# Altium schematic sheet USB-connector.SchDoc
size B; SheetNumber: 1; SheetTotal: 1
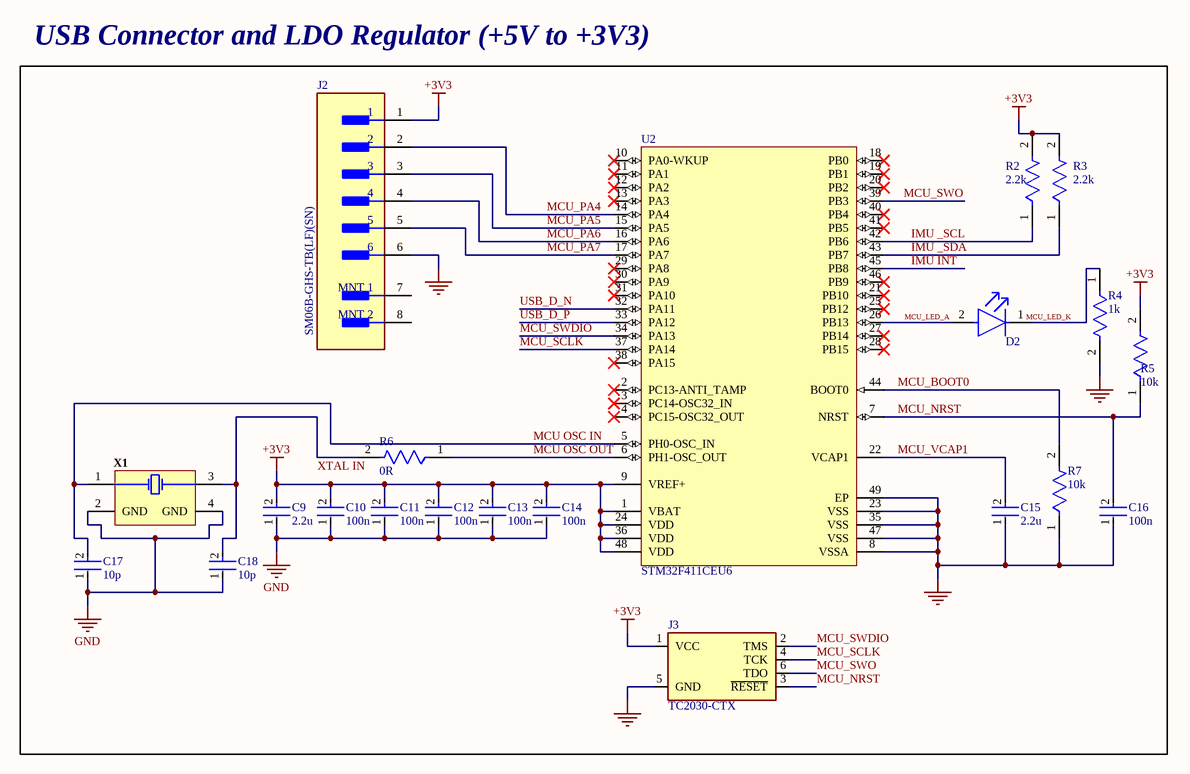
[diagram p0: USB-connector.SchDoc]

## Parts
C9  2.2u  [FP-GRM15-MFG]
C10  100n  [FP-GRM15-MFG]
C11  100n  [FP-GRM15-MFG]
C12  100n  [FP-GRM15-MFG]
C13  100n  [FP-GRM15-MFG]
C14  100n  [FP-GRM15-MFG]
C15  2.2u  [FP-GRM15-MFG]
C16  100n  [FP-GRM15-MFG]
C17  10p  [FP-GRM15-MFG]
C18  10p  [FP-GRM15-MFG]
D2  SML-P11UTT86  [FP-SML-P11UTT86-MFG]  (value not drawn)
J2  SM06B-GHS-TB(LF)(SN)  [FP-SM06B-GHS-TB_LF_SN-MFG]
J3  TC2030-CTX  [TC2030-IDC-NL]
R2  2.2k  [FP-CRCW0402-e3-IPC_C]
R3  2.2k  [FP-CRCW0402-e3-IPC_C]
R4  1k  [FP-CRCW0402-e3-IPC_C]
R5  10k  [FP-CRCW0402-e3-IPC_C]
R6  0R  [FP-CRCW0402-e3-IPC_C]
R7  10k  [FP-CRCW0402-e3-IPC_C]
U2  STM32F411CEU6  [STM-UFQFPN48_L]
X1  TSX-3225 24.0000MF15X-AC3  [EPSON-TSX-3225_V]  (value not drawn)

## Blocks framed on the sheet
USB Connector and LDO Regulator (+5V to +3V3): C9-C18 D2 J2 J3 R2-R7 U2 X1

## Nets
+3V3: C9.2 C10.2 C11.2 C12.2 C13.2 C14.2 J2.1 J3.1(VCC) R2.2 R3.2 R5.2 U2.1(VBAT) U2.9(VREF+) U2.24(VDD) U2.36(VDD) U2.48(VDD)
GND: C9.1 C10.1 C11.1 C12.1 C13.1 C14.1 C15.1 C16.1 C17.1 C18.1 J2.6 J3.5(GND) R4.2 R7.1 U2.8(VSSA) U2.23(VSS) U2.35(VSS) U2.47(VSS) U2.49(EP) X1.2(GND) X1.4(GND)
IMU _SCL: R2.1 U2.42(PB6)
IMU _SDA: R3.1 U2.43(PB7)
IMU INT: U2.45(PB8)
MCU OSC IN: C17.2 U2.5(PH0-OSC_IN) X1.1(X1)
MCU OSC OUT: R6.1 U2.6(PH1-OSC_OUT)
MCU_BOOT0: R7.2 U2.44(BOOT0)
MCU_LED_A: D2.2(A) U2.26(PB13)
MCU_LED_K: D2.1(C) R4.1
MCU_NRST: C16.2 J3.3(~{RESET}) R5.1 U2.7(NRST)
MCU_PA4: J2.2 U2.14(PA4)
MCU_PA5: J2.3 U2.15(PA5)
MCU_PA6: J2.4 U2.16(PA6)
MCU_PA7: J2.5 U2.17(PA7)
MCU_SCLK: J3.4(TCK) U2.37(PA14)
MCU_SWDIO: J3.2(TMS) U2.34(PA13)
MCU_SWO: J3.6(TDO) U2.39(PB3)
MCU_VCAP1: C15.2 U2.22(VCAP1)
USB_D_N: U2.32(PA11)
USB_D_P: U2.33(PA12)
XTAL IN: C18.2 R6.2 X1.3(X2)

Not connected (* = marked no-connect by the designer): J2 7(MNT_1) 8(MNT_2); U2 2(PC13-ANTI_TAMP)* 3(PC14-OSC32_IN)* 4(PC15-OSC32_OUT)* 10(PA0-WKUP)* 11(PA1)* 12(PA2)* 13(PA3)* 18(PB0)* 19(PB1)* 20(PB2)* 21(PB10)* 25(PB12)* 27(PB14)* 28(PB15)* 29(PA8)* 30(PA9)* 31(PA10)* 38(PA15)* 40(PB4)* 41(PB5)* 46(PB9)*

## Library data of the parts
C9-C18 = CMP-2100-03641-2: CAP CER 0.1UF 16V X7R 0402; Manufacturer Part Number: GRM155R71C104KA88D; Manufacturer: Murata; Standoff Height: 0mm; Tolerance: 10%; Voltage Rating: 16Vdc; Material: Ceramic; Capacitance: 0.10μF; Value: 0.10μF; RoHS: TRUE; Temperature Characteristic: X7R; Octopart: https://octopart.com/grm155r71c104ka88d-murata-196880; Digikey Description: CAP CER 0.1UF 16V X7R 0402; Device Class L3: Ceramic Capacitors; Height: 0.55mm; ComponentLink2Description: Datasheet; Temperature Range Low: -55°C; Ipc Land Pattern Name: CAPC10050X219; ComponentLink2URL: https://search.murata.co.jp/Ceramy/image/img/A01X/G101/ENG/GRM155R71H471KA01-01A.pdf; Device Class L1: Passive Components; Lead Free: yes; Category: Cap; Package: GRM15; Temperature: -55°C to +125°C; Device Class L2: Capacitors; Temperature Range High: +125°C; Mouser Description: 0402 0.1 uF 16V ±10 % Tolerance X7R SMT Multilayer Ceramic Capacitor
D2 = CMP-08952-000028-1: LED RED CLEAR 1006 SMD; Number of LEDs: 1; Lens Color: Colorless; Viewing Angle: 150°; Dominant Wavelength: 621nm; Luminous Intensity: 5.5mcd; Forward Voltage: 1.8V; Lens Style: Square; Test Current: 1mA; Forward Current: 20mA; Height: 0.25mm; Radiation Hardening: No; Color: Red; Case Code (Metric): 1005; Number of Pins: 2; RoHS Compliant: Yes; Max Operating Temperature: 85°C; Package Quantity: 1; Wavelength: 621nm; Lens Transparency: Clear; Packaging: Tape and Reel; Lead Free: Lead Free; Illumination Color: Red; Case/Package: 0402; Case Code (Imperial): 0402; Mount: Surface Mount; Min Operating Temperature: -40°C; Width: 0.6mm; Length: 1mm; Series: PicoLED™; REACH SVHC: No SVHC
J2 = CMP-17439-000061-1: CONN HEADER SMD R/A 6POS 1.25MM; Number of Contacts: 6; Voltage Rating: 50V; Current Rating: 1A; Connector Type: Outer Shroud Contact; Contact Resistance: 50mR; Orientation: Right Angle; Max Operating Temperature: 85°C; Mount: Surface Mount; Packaging: Tape and Reel; Contact Plating: Tin; Depth: 4.05mm; Max Voltage Rating (AC): 50V; Lead Free: Lead Free; Pitch: 1.25mm; Number of Positions: 6; Max Current Rating: 1A; Termination: Solder; Min Operating Temperature: -25°C; Housing Color: Beige; Fastening Type: Ramp; Length: 10.75mm; Color: Natural; Contact Material: Bronze; Housing Material: Polyamide; Number of Rows: 1
J3 = CMP-003-000000-1: CortexÂ® Plug-Of-Nailsâ„¢ Adapter Cable; MF: Tag-Connect LLC; Price: None; Value: *; Source: SnapEDAsch.SchLib; Availability: Unavailable; SnapEDA_Link: https://www.snapeda.com/parts/TC2030-CTX/Tag-Connect%20LLC/view-part/225831/?ref=snap; Package: None; Component Type: Standard; MP: TC2030-CTX; Design Item ID: TC2030-CTX; Pin Count: 6
R2-R7 = CMP-2002-08122-2: RES Thick Film, 0Ω, 0.063W, 0402; Tolerance: 5%; Max Power Dissipation: 63mW; Voltage Rating: 50V; Temperature Coefficient: 100ppm/°C; Resistance: 0mR; Contact Plating: Tin; Height: 0.35mm; Radiation Hardening: No; Features: Automotive AEC-Q200; Composition: Thick Film; Width: 0.5mm; Weight: 2.3E-05oz; Termination: SMD/SMT; Packaging: Tape and Reel; Mount: Surface Mount; Case Code (Metric): 1005; Military Standard: Not; Min Operating Temperature: -55°C; Number of Terminations: 2; Package Quantity: 1; Case Code (Imperial): 0402; Depth: 0.5mm; Max Operating Temperature: 155°C; Case/Package: 0402; Power Rating: 63mW; Lead Free: Lead Free; Voltage Rating (DC): 50V; Length: 1mm
U2 = CMP-0243-00165-1: ARM Cortex-M4 32-bit MCU+FPU, 512 KB Flash, 128 KB RAM, 36 I/Os, 48-Pin UFQFPN, -40 to 85 degC, Tray; Operating Frequency(F) (Processor speed) (MHz): 100; FLASH Size (Prog) (kB): 512; Internal RAM Size (kB): 128; I/Os (High Current): 36; Supply Voltage(Vcc) min (V): 1.7; Package Reference: 48-Pin Ultra Thin Fine Pitch Quad Flat No-Lead, 7 x 7 x 0.6 mm Body, 0.5 mm Pitch, Exposed Pad; ComponentLink1Description: Manufacturer URL; ComponentLink1URL: http://www.st.com/; Packing: Tray; Package Description: UFQFPN48; Core: ARM Cortex-M4; ComponentLink2Description: Datasheet; ComponentLink2URL: http://www.st.com/st-web-ui/static/active/en/resource/technical/document/datasheet/DM00115249.pdf; DatasheetVersion: Rev. 6; Mounting Technology: Surface Mount
X1 = CMP-2000-07333-1: MHz Range Crystal, 24 MHz, -40 to 85 degC, 4-Pin SMD, RoHS, Tape and Reel; Manufacturer: Epson; Brand: EpsonTiming; Frequency Stability: 10PPM; Frequency: 24MHz; ESR: 40Ohms; Load Capacitance: 9pF; Unit Weight: 0.000564oz; Drive Level: 200uW; Datasheet Version: 12/2015; RoHS: True; Operating Temperature Range: -40Cto+85C; Length: 3.2mm; Tolerance: 10PPM; Width: 2.5mm; Mounting Technology: SurfaceMount; Package Description: 4-Pin Surface Mount Device, Body 3.2 x 2.5 mm; Manufacturer URL: https://www.eea.epson.com/; Factory Pack Quantity: 250; Package Reference: TSX-3225; Height: 0.6mm; Mounting Style: SMD/SMT; Termination Style: SMD/SMT; Datasheet URL: https://support.epson.biz/td/api/doc_check.php?dl=brief_FA-238V_en.pdf; Type: Crystal; Series: TSX-3225; Package / Case: 3.2mmx2.5mm; Product Category: Crystals; Packaging: Reel